# Altium schematic sheet eva01_connectors.SchDoc: DevelBoard EVA Main Connectors
size A3; Author: Daniele Basile <asterix@develer.com>; Organization: Develer s.r.l.; Address1: via Mugellese 1/A; Address2: 50019 Campi Bisenzio; Address3: Firenze; Address4: ITALY; DocumentNumber: 1; Revision: EVA 0; SheetNumber: 1; SheetTotal: 3
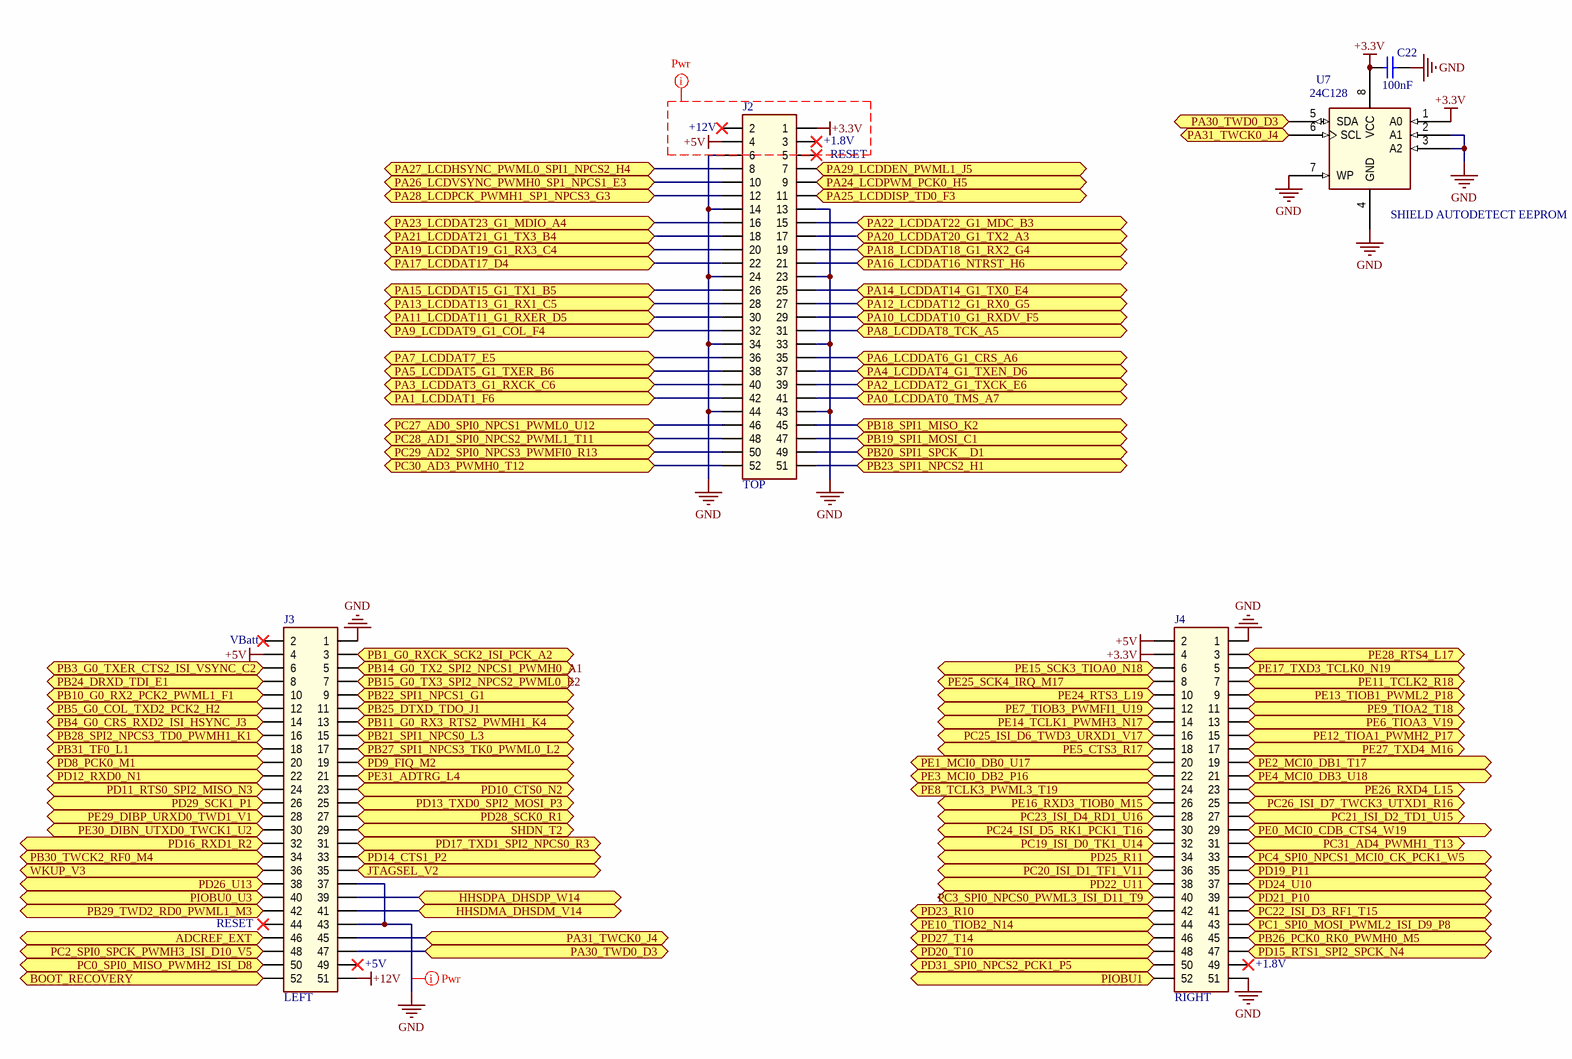
[diagram p0: eva01_connectors.SchDoc]

## Parts
C22  100nF  [0603_[1608]]
J2  TOP  [SOCKET_2x26_2.54MM_THD]
J3  LEFT  [SOCKET_2x26_2.54MM_THD]
J4  RIGHT  [SOCKET_2x26_2.54MM_THD]
U7  24C128  [SOIC8]

## Ports
ADCREF_EXT, BOOT_RECOVERY, HHSDMA_DHSDM_V14, HHSDPA_DHSDP_W14, JTAGSEL_V2, PA0_LCDDAT0_TMS_A7, PA1_LCDDAT1_F6, PA2_LCDDAT2_G1_TXCK_E6, PA3_LCDDAT3_G1_RXCK_C6, PA4_LCDDAT4_G1_TXEN_D6, PA5_LCDDAT5_G1_TXER_B6, PA6_LCDDAT6_G1_CRS_A6, PA7_LCDDAT7_E5, PA8_LCDDAT8_TCK_A5, PA9_LCDDAT9_G1_COL_F4, PA10_LCDDAT10_G1_RXDV_F5, PA11_LCDDAT11_G1_RXER_D5, PA12_LCDDAT12_G1_RX0_G5, PA13_LCDDAT13_G1_RX1_C5, PA14_LCDDAT14_G1_TX0_E4, PA15_LCDDAT15_G1_TX1_B5, PA16_LCDDAT16_NTRST_H6, PA17_LCDDAT17_D4, PA18_LCDDAT18_G1_RX2_G4, PA19_LCDDAT19_G1_RX3_C4, PA20_LCDDAT20_G1_TX2_A3, PA21_LCDDAT21_G1_TX3_B4, PA22_LCDDAT22_G1_MDC_B3, PA23_LCDDAT23_G1_MDIO_A4, PA24_LCDPWM_PCK0_H5, PA25_LCDDISP_TD0_F3, PA26_LCDVSYNC_PWMH0_SP1_NPCS1_E3, PA27_LCDHSYNC_PWML0_SPI1_NPCS2_H4, PA28_LCDPCK_PWMH1_SP1_NPCS3_G3, PA29_LCDDEN_PWML1_J5, PA30_TWD0_D3, PA31_TWCK0_J4, PB1_G0_RXCK_SCK2_ISI_PCK_A2, PB3_G0_TXER_CTS2_ISI_VSYNC_C2, PB4_G0_CRS_RXD2_ISI_HSYNC_J3, PB5_G0_COL_TXD2_PCK2_H2, PB10_G0_RX2_PCK2_PWML1_F1, PB11_G0_RX3_RTS2_PWMH1_K4, PB14_G0_TX2_SPI2_NPCS1_PWMH0_A1, PB15_G0_TX3_SPI2_NPCS2_PWML0_E2, PB18_SPI1_MISO_K2, PB19_SPI1_MOSI_C1, PB20_SPI1_SPCK__D1, PB21_SPI1_NPCS0_L3, PB22_SPI1_NPCS1_G1, PB23_SPI1_NPCS2_H1, PB24_DRXD_TDI_E1, PB25_DTXD_TDO_J1, PB26_PCK0_RK0_PWMH0_M5, PB27_SPI1_NPCS3_TK0_PWML0_L2, PB28_SPI2_NPCS3_TD0_PWMH1_K1, PB29_TWD2_RD0_PWML1_M3, PB30_TWCK2_RF0_M4, PB31_TF0_L1, PC0_SPI0_MISO_PWMH2_ISI_D8, PC1_SPI0_MOSI_PWML2_ISI_D9_P8, PC2_SPI0_SPCK_PWMH3_ISI_D10_V5, PC3_SPI0_NPCS0_PWML3_ISI_D11_T9, PC4_SPI0_NPCS1_MCI0_CK_PCK1_W5, PC19_ISI_D0_TK1_U14, PC20_ISI_D1_TF1_V11, PC21_ISI_D2_TD1_U15, PC22_ISI_D3_RF1_T15, PC23_ISI_D4_RD1_U16, PC24_ISI_D5_RK1_PCK1_T16, PC25_ISI_D6_TWD3_URXD1_V17, PC26_ISI_D7_TWCK3_UTXD1_R16, PC27_AD0_SPI0_NPCS1_PWML0_U12, PC28_AD1_SPI0_NPCS2_PWML1_T11, PC29_AD2_SPI0_NPCS3_PWMFI0_R13, PC30_AD3_PWMH0_T12, PC31_AD4_PWMH1_T13, PD8_PCK0_M1, PD9_FIQ_M2, PD10_CTS0_N2, PD11_RTS0_SPI2_MISO_N3, PD12_RXD0_N1, PD13_TXD0_SPI2_MOSI_P3, PD14_CTS1_P2, PD15_RTS1_SPI2_SPCK_N4, PD16_RXD1_R2, PD17_TXD1_SPI2_NPCS0_R3, PD19_P11, PD20_T10, PD21_P10, PD22_U11, PD23_R10, PD24_U10, PD25_R11, PD26_U13, PD27_T14, PD28_SCK0_R1, PD29_SCK1_P1, PD31_SPI0_NPCS2_PCK1_P5, PE0_MCI0_CDB_CTS4_W19, PE1_MCI0_DB0_U17, PE2_MCI0_DB1_T17, PE3_MCI0_DB2_P16, PE4_MCI0_DB3_U18, PE5_CTS3_R17, PE6_TIOA3_V19, PE7_TIOB3_PWMFI1_U19, PE8_TCLK3_PWML3_T19, PE9_TIOA2_T18, PE10_TIOB2_N14, PE11_TCLK2_R18, PE12_TIOA1_PWMH2_P17, PE13_TIOB1_PWML2_P18, PE14_TCLK1_PWMH3_N17, PE15_SCK3_TIOA0_N18, PE16_RXD3_TIOB0_M15, PE17_TXD3_TCLK0_N19, PE24_RTS3_L19, PE25_SCK4_IRQ_M17, PE26_RXD4_L15, PE27_TXD4_M16, PE28_RTS4_L17, PE29_DIBP_URXD0_TWD1_V1, PE30_DIBN_UTXD0_TWCK1_U2, PE31_ADTRG_L4, PIOBU0_U3, PIOBU1, SHDN_T2, WKUP_V3

## Nets
+3.3V: C22.2 J2.1 J4.4 U7.1(A0) U7.8(VCC)
+5V: J2.4 J3.4 J4.2
+12V: J3.51
GND: C22.1 J2.6 J2.13 J2.14 J2.23 J2.24 J2.33 J2.34 J2.43 J2.44 J3.1 J3.37 J3.43 J4.1 J4.51 U7.2(A1) U7.3(A2) U7.4(GND) U7.7(WP)
ADCREF_EXT: J3.46 ; port ADCREF_EXT
BOOT_RECOVERY: J3.52 ; port BOOT_RECOVERY
HHSDMA_DHSDM_V14: J3.41 ; port HHSDMA_DHSDM_V14
HHSDPA_DHSDP_W14: J3.39 ; port HHSDPA_DHSDP_W14
JTAGSEL_V2: J3.35 ; port JTAGSEL_V2
PA0_LCDDAT0_TMS_A7: J2.41 ; port PA0_LCDDAT0_TMS_A7
PA1_LCDDAT1_F6: J2.42 ; port PA1_LCDDAT1_F6
PA2_LCDDAT2_G1_TXCK_E6: J2.39 ; port PA2_LCDDAT2_G1_TXCK_E6
PA3_LCDDAT3_G1_RXCK_C6: J2.40 ; port PA3_LCDDAT3_G1_RXCK_C6
PA4_LCDDAT4_G1_TXEN_D6: J2.37 ; port PA4_LCDDAT4_G1_TXEN_D6
PA5_LCDDAT5_G1_TXER_B6: J2.38 ; port PA5_LCDDAT5_G1_TXER_B6
PA6_LCDDAT6_G1_CRS_A6: J2.35 ; port PA6_LCDDAT6_G1_CRS_A6
PA7_LCDDAT7_E5: J2.36 ; port PA7_LCDDAT7_E5
PA8_LCDDAT8_TCK_A5: J2.31 ; port PA8_LCDDAT8_TCK_A5
PA9_LCDDAT9_G1_COL_F4: J2.32 ; port PA9_LCDDAT9_G1_COL_F4
PA10_LCDDAT10_G1_RXDV_F5: J2.29 ; port PA10_LCDDAT10_G1_RXDV_F5
PA11_LCDDAT11_G1_RXER_D5: J2.30 ; port PA11_LCDDAT11_G1_RXER_D5
PA12_LCDDAT12_G1_RX0_G5: J2.27 ; port PA12_LCDDAT12_G1_RX0_G5
PA13_LCDDAT13_G1_RX1_C5: J2.28 ; port PA13_LCDDAT13_G1_RX1_C5
PA14_LCDDAT14_G1_TX0_E4: J2.25 ; port PA14_LCDDAT14_G1_TX0_E4
PA15_LCDDAT15_G1_TX1_B5: J2.26 ; port PA15_LCDDAT15_G1_TX1_B5
PA16_LCDDAT16_NTRST_H6: J2.21 ; port PA16_LCDDAT16_NTRST_H6
PA17_LCDDAT17_D4: J2.22 ; port PA17_LCDDAT17_D4
PA18_LCDDAT18_G1_RX2_G4: J2.19 ; port PA18_LCDDAT18_G1_RX2_G4
PA19_LCDDAT19_G1_RX3_C4: J2.20 ; port PA19_LCDDAT19_G1_RX3_C4
PA20_LCDDAT20_G1_TX2_A3: J2.17 ; port PA20_LCDDAT20_G1_TX2_A3
PA21_LCDDAT21_G1_TX3_B4: J2.18 ; port PA21_LCDDAT21_G1_TX3_B4
PA22_LCDDAT22_G1_MDC_B3: J2.15 ; port PA22_LCDDAT22_G1_MDC_B3
PA23_LCDDAT23_G1_MDIO_A4: J2.16 ; port PA23_LCDDAT23_G1_MDIO_A4
PA24_LCDPWM_PCK0_H5: J2.9 ; port PA24_LCDPWM_PCK0_H5
PA25_LCDDISP_TD0_F3: J2.11 ; port PA25_LCDDISP_TD0_F3
PA26_LCDVSYNC_PWMH0_SP1_NPCS1_E3: J2.10 ; port PA26_LCDVSYNC_PWMH0_SP1_NPCS1_E3
PA27_LCDHSYNC_PWML0_SPI1_NPCS2_H4: J2.8 ; port PA27_LCDHSYNC_PWML0_SPI1_NPCS2_H4
PA28_LCDPCK_PWMH1_SP1_NPCS3_G3: J2.12 ; port PA28_LCDPCK_PWMH1_SP1_NPCS3_G3
PA29_LCDDEN_PWML1_J5: J2.7 ; port PA29_LCDDEN_PWML1_J5
PA30_TWD0_D3: J3.47 U7.5(SDA) ; port PA30_TWD0_D3
PA31_TWCK0_J4: J3.45 U7.6(SCL) ; port PA31_TWCK0_J4
PB1_G0_RXCK_SCK2_ISI_PCK_A2: J3.3 ; port PB1_G0_RXCK_SCK2_ISI_PCK_A2
PB3_G0_TXER_CTS2_ISI_VSYNC_C2: J3.6 ; port PB3_G0_TXER_CTS2_ISI_VSYNC_C2
PB4_G0_CRS_RXD2_ISI_HSYNC_J3: J3.14 ; port PB4_G0_CRS_RXD2_ISI_HSYNC_J3
PB5_G0_COL_TXD2_PCK2_H2: J3.12 ; port PB5_G0_COL_TXD2_PCK2_H2
PB10_G0_RX2_PCK2_PWML1_F1: J3.10 ; port PB10_G0_RX2_PCK2_PWML1_F1
PB11_G0_RX3_RTS2_PWMH1_K4: J3.13 ; port PB11_G0_RX3_RTS2_PWMH1_K4
PB14_G0_TX2_SPI2_NPCS1_PWMH0_A1: J3.5 ; port PB14_G0_TX2_SPI2_NPCS1_PWMH0_A1
PB15_G0_TX3_SPI2_NPCS2_PWML0_E2: J3.7 ; port PB15_G0_TX3_SPI2_NPCS2_PWML0_E2
PB18_SPI1_MISO_K2: J2.45 ; port PB18_SPI1_MISO_K2
PB19_SPI1_MOSI_C1: J2.47 ; port PB19_SPI1_MOSI_C1
PB20_SPI1_SPCK__D1: J2.49 ; port PB20_SPI1_SPCK__D1
PB21_SPI1_NPCS0_L3: J3.15 ; port PB21_SPI1_NPCS0_L3
PB22_SPI1_NPCS1_G1: J3.9 ; port PB22_SPI1_NPCS1_G1
PB23_SPI1_NPCS2_H1: J2.51 ; port PB23_SPI1_NPCS2_H1
PB24_DRXD_TDI_E1: J3.8 ; port PB24_DRXD_TDI_E1
PB25_DTXD_TDO_J1: J3.11 ; port PB25_DTXD_TDO_J1
PB26_PCK0_RK0_PWMH0_M5: J4.45 ; port PB26_PCK0_RK0_PWMH0_M5
PB27_SPI1_NPCS3_TK0_PWML0_L2: J3.17 ; port PB27_SPI1_NPCS3_TK0_PWML0_L2
PB28_SPI2_NPCS3_TD0_PWMH1_K1: J3.16 ; port PB28_SPI2_NPCS3_TD0_PWMH1_K1
PB29_TWD2_RD0_PWML1_M3: J3.42 ; port PB29_TWD2_RD0_PWML1_M3
PB30_TWCK2_RF0_M4: J3.34 ; port PB30_TWCK2_RF0_M4
PB31_TF0_L1: J3.18 ; port PB31_TF0_L1
PC0_SPI0_MISO_PWMH2_ISI_D8: J3.50 ; port PC0_SPI0_MISO_PWMH2_ISI_D8
PC1_SPI0_MOSI_PWML2_ISI_D9_P8: J4.43 ; port PC1_SPI0_MOSI_PWML2_ISI_D9_P8
PC2_SPI0_SPCK_PWMH3_ISI_D10_V5: J3.48 ; port PC2_SPI0_SPCK_PWMH3_ISI_D10_V5
PC3_SPI0_NPCS0_PWML3_ISI_D11_T9: J4.40 ; port PC3_SPI0_NPCS0_PWML3_ISI_D11_T9
PC4_SPI0_NPCS1_MCI0_CK_PCK1_W5: J4.33 ; port PC4_SPI0_NPCS1_MCI0_CK_PCK1_W5
PC19_ISI_D0_TK1_U14: J4.32 ; port PC19_ISI_D0_TK1_U14
PC20_ISI_D1_TF1_V11: J4.36 ; port PC20_ISI_D1_TF1_V11
PC21_ISI_D2_TD1_U15: J4.27 ; port PC21_ISI_D2_TD1_U15
PC22_ISI_D3_RF1_T15: J4.41 ; port PC22_ISI_D3_RF1_T15
PC23_ISI_D4_RD1_U16: J4.28 ; port PC23_ISI_D4_RD1_U16
PC24_ISI_D5_RK1_PCK1_T16: J4.30 ; port PC24_ISI_D5_RK1_PCK1_T16
PC25_ISI_D6_TWD3_URXD1_V17: J4.16 ; port PC25_ISI_D6_TWD3_URXD1_V17
PC26_ISI_D7_TWCK3_UTXD1_R16: J4.25 ; port PC26_ISI_D7_TWCK3_UTXD1_R16
PC27_AD0_SPI0_NPCS1_PWML0_U12: J2.46 ; port PC27_AD0_SPI0_NPCS1_PWML0_U12
PC28_AD1_SPI0_NPCS2_PWML1_T11: J2.48 ; port PC28_AD1_SPI0_NPCS2_PWML1_T11
PC29_AD2_SPI0_NPCS3_PWMFI0_R13: J2.50 ; port PC29_AD2_SPI0_NPCS3_PWMFI0_R13
PC30_AD3_PWMH0_T12: J2.52 ; port PC30_AD3_PWMH0_T12
PC31_AD4_PWMH1_T13: J4.31 ; port PC31_AD4_PWMH1_T13
PD8_PCK0_M1: J3.20 ; port PD8_PCK0_M1
PD9_FIQ_M2: J3.19 ; port PD9_FIQ_M2
PD10_CTS0_N2: J3.23 ; port PD10_CTS0_N2
PD11_RTS0_SPI2_MISO_N3: J3.24 ; port PD11_RTS0_SPI2_MISO_N3
PD12_RXD0_N1: J3.22 ; port PD12_RXD0_N1
PD13_TXD0_SPI2_MOSI_P3: J3.25 ; port PD13_TXD0_SPI2_MOSI_P3
PD14_CTS1_P2: J3.33 ; port PD14_CTS1_P2
PD15_RTS1_SPI2_SPCK_N4: J4.47 ; port PD15_RTS1_SPI2_SPCK_N4
PD16_RXD1_R2: J3.32 ; port PD16_RXD1_R2
PD17_TXD1_SPI2_NPCS0_R3: J3.31 ; port PD17_TXD1_SPI2_NPCS0_R3
PD19_P11: J4.35 ; port PD19_P11
PD20_T10: J4.48 ; port PD20_T10
PD21_P10: J4.39 ; port PD21_P10
PD22_U11: J4.38 ; port PD22_U11
PD23_R10: J4.42 ; port PD23_R10
PD24_U10: J4.37 ; port PD24_U10
PD25_R11: J4.34 ; port PD25_R11
PD26_U13: J3.38 ; port PD26_U13
PD27_T14: J4.46 ; port PD27_T14
PD28_SCK0_R1: J3.27 ; port PD28_SCK0_R1
PD29_SCK1_P1: J3.26 ; port PD29_SCK1_P1
PD31_SPI0_NPCS2_PCK1_P5: J4.50 ; port PD31_SPI0_NPCS2_PCK1_P5
PE0_MCI0_CDB_CTS4_W19: J4.29 ; port PE0_MCI0_CDB_CTS4_W19
PE1_MCI0_DB0_U17: J4.20 ; port PE1_MCI0_DB0_U17
PE2_MCI0_DB1_T17: J4.19 ; port PE2_MCI0_DB1_T17
PE3_MCI0_DB2_P16: J4.22 ; port PE3_MCI0_DB2_P16
PE4_MCI0_DB3_U18: J4.21 ; port PE4_MCI0_DB3_U18
PE5_CTS3_R17: J4.18 ; port PE5_CTS3_R17
PE6_TIOA3_V19: J4.13 ; port PE6_TIOA3_V19
PE7_TIOB3_PWMFI1_U19: J4.12 ; port PE7_TIOB3_PWMFI1_U19
PE8_TCLK3_PWML3_T19: J4.24 ; port PE8_TCLK3_PWML3_T19
PE9_TIOA2_T18: J4.11 ; port PE9_TIOA2_T18
PE10_TIOB2_N14: J4.44 ; port PE10_TIOB2_N14
PE11_TCLK2_R18: J4.7 ; port PE11_TCLK2_R18
PE12_TIOA1_PWMH2_P17: J4.15 ; port PE12_TIOA1_PWMH2_P17
PE13_TIOB1_PWML2_P18: J4.9 ; port PE13_TIOB1_PWML2_P18
PE14_TCLK1_PWMH3_N17: J4.14 ; port PE14_TCLK1_PWMH3_N17
PE15_SCK3_TIOA0_N18: J4.6 ; port PE15_SCK3_TIOA0_N18
PE16_RXD3_TIOB0_M15: J4.26 ; port PE16_RXD3_TIOB0_M15
PE17_TXD3_TCLK0_N19: J4.5 ; port PE17_TXD3_TCLK0_N19
PE24_RTS3_L19: J4.10 ; port PE24_RTS3_L19
PE25_SCK4_IRQ_M17: J4.8 ; port PE25_SCK4_IRQ_M17
PE26_RXD4_L15: J4.23 ; port PE26_RXD4_L15
PE27_TXD4_M16: J4.17 ; port PE27_TXD4_M16
PE28_RTS4_L17: J4.3 ; port PE28_RTS4_L17
PE29_DIBP_URXD0_TWD1_V1: J3.28 ; port PE29_DIBP_URXD0_TWD1_V1
PE30_DIBN_UTXD0_TWCK1_U2: J3.30 ; port PE30_DIBN_UTXD0_TWCK1_U2
PE31_ADTRG_L4: J3.21 ; port PE31_ADTRG_L4
PIOBU0_U3: J3.40 ; port PIOBU0_U3
PIOBU1: J4.52 ; port PIOBU1
SHDN_T2: J3.29 ; port SHDN_T2
WKUP_V3: J3.36 ; port WKUP_V3

Not connected (* = marked no-connect by the designer): J2 2* 3* 5*; J3 2* 44* 49*; J4 49*

## Layout directives
net class Power: +3.3V, +5V, GND

## Notes on the sheet
- (near J2) +12V
- (near J2) +1.8V
- (near J2) RESET
- (near U7) SHIELD AUTODETECT EEPROM
- (near J3) VBatt
- (near J3) RESET
- (near J3) +5V
- (near J4) +1.8V
- Title:
- Author:
- License:
- BSD
- Rev:
- Size:
- A3
- File:
- Date:
- Time:
- Sheet
- of

## Library data of the parts
C22 = Cap: Ceramic X7R 50V; Value: 10nF; Published: 8-Jun-2000; Revision: July-2002: Re-released for DXP Platform.; Publisher: Altium Limited
J2-J4 = Header 26x2: Socket Header, 52 pin, 26x2, 2.54mm, H=8.5mm; Part Number: Tyco 1-1634688; Purchase Code: RS 473-8254
U7 = EEPROM-SOIC8: EEPROM